# EAGLE design NST-28037B (EAGLE 7.2.0)
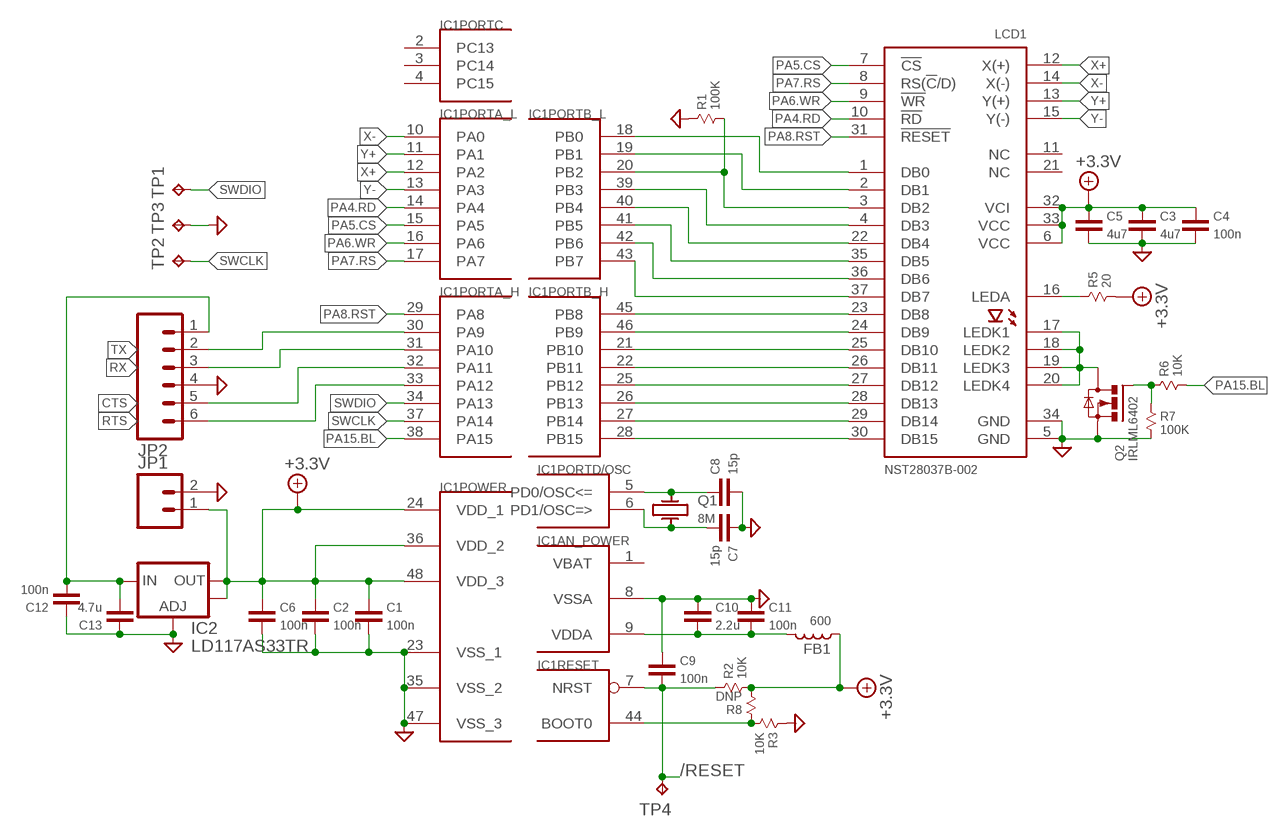
[diagram p0: schematic, sheet 1]

## Parts
C1  100n  CAP-0603  [0603]
C2  100n  CAP-0603  [0603]
C3  4u7  CAP-0603  [0603]
C4  100n  CAP-0603  [0603]
C5  4u7  CAP-0603  [0603]
C6  100n  CAP-0603  [0603]
C7  15p  CAP-0603  [0603]
C8  15p  CAP-0603  [0603]
C9  100n  CAP-0603  [0603]
C10  2.2u  CAP-0603  [0603]
C11  100n  CAP-0603  [0603]
C12  100n  CAP-0603  [0603]
C13  4.7u  CAP-0603  [0603]
FB1  600  INDUCTOR-0603  [0603]
IC1  STM32F10XCXT6  [TQFP48]
IC2  LD117AS33TR  [SOT223]
JP1  M02PTH  [1X02]
JP2  M06SIP  [1X06]
LCD1  NST28037B-002  [NST28037B-002]
Q1  8M  CRYSTAL-KX-9A  [KX-9A]
Q2  IRLML6402  MOSFET-N-SOT23  [SOT-23]
R1  100K  RESISTOR-0603  [0603]
R2  10K  RESISTOR-0603  [0603]
R3  10K  RESISTOR-0603  [0603]
R5  20  RESISTOR-0805  [0805]
R6  10K  RESISTOR-0603  [0603]
R7  100K  RESISTOR-0603  [0603]
R8  DNP  RESISTOR-0603  [0603]
TP1  TPTP12R  [TP12R]
TP2  TPTP12R  [TP12R]
TP3  TPTP12R  [TP12R]
TP4  TPTP12R  [TP12R]

## Nets
+3.3V: C1.2 C2.2 C3.2 C4.2 C5.2 C6.2 FB1.1 IC1.24(POWER:VDD_1) IC1.36(POWER:VDD_2) IC1.48(POWER:VDD_3) IC2.2(OUT) IC2.4(OUT) JP1.1 LCD1.6(VCC) LCD1.32(VCI) LCD1.33(VCC) R2.2 R5.2 R8.2
/RESET: C9.1 IC1.7(RESET:NRST) R2.1 TP4.TP
CTS: IC1.32(PORTA_H:PA11) JP2.5
D0: IC1.18(PORTB_L:PB0) LCD1.1(DB0)
D1: IC1.19(PORTB_L:PB1) LCD1.2(DB1)
D2: IC1.20(PORTB_L:PB2) LCD1.3(DB2) R1.2
D3: IC1.39(PORTB_L:PB3) LCD1.4(DB3)
D4: IC1.40(PORTB_L:PB4) LCD1.22(DB4)
D5: IC1.41(PORTB_L:PB5) LCD1.35(DB5)
D6: IC1.42(PORTB_L:PB6) LCD1.36(DB6)
D7: IC1.43(PORTB_L:PB7) LCD1.37(DB7)
D8: IC1.45(PORTB_H:PB8) LCD1.23(DB8)
D9: IC1.46(PORTB_H:PB9) LCD1.24(DB9)
D10: IC1.21(PORTB_H:PB10) LCD1.25(DB10)
D11: IC1.22(PORTB_H:PB11) LCD1.26(DB11)
D12: IC1.25(PORTB_H:PB12) LCD1.27(DB12)
D13: IC1.26(PORTB_H:PB13) LCD1.28(DB13)
D14: IC1.27(PORTB_H:PB14) LCD1.29(DB14)
D15: IC1.28(PORTB_H:PB15) LCD1.30(DB15)
GND: C1.1 C2.1 C3.1 C4.1 C5.1 C6.1 C7.2 C8.1 C9.2 C10.2 C11.2 C12.2 C13.2 IC1.8(AN_POWER:VSSA) IC1.23(POWER:VSS_1) IC1.35(POWER:VSS_2) IC1.47(POWER:VSS_3) IC2.1(ADJ) JP1.2 JP2.4 LCD1.5(GND) LCD1.34(GND) Q2.2(S) R1.1 R3.1 R7.2 TP3.TP
LEDA-1: LCD1.16(LEDA) R5.1
LEDK: LCD1.17(LEDK1) LCD1.18(LEDK2) LCD1.19(LEDK3) LCD1.20(LEDK4) Q2.3(D)
N$1: C8.2 IC1.5(PORTD/OSC:PD0/OSC<=) Q1.1
N$2: C7.1 IC1.6(PORTD/OSC:PD1/OSC=>) Q1.3
N$3: Q2.1(G) R6.1 R7.1
N$7: C10.1 C11.1 FB1.2 IC1.9(AN_POWER:VDDA)
N$8: IC1.44(RESET:BOOT0) R3.2 R8.1
PA4.RD: IC1.14(PORTA_L:PA4) LCD1.10(!RD)
PA5.CS: IC1.15(PORTA_L:PA5) LCD1.7(!CS)
PA6.WR: IC1.16(PORTA_L:PA6) LCD1.9(!WR)
PA7.RS: IC1.17(PORTA_L:PA7) LCD1.8(RS(!C!/D))
PA8.RST: IC1.29(PORTA_H:PA8) LCD1.31(!RESET)
PA15.BL: IC1.38(PORTA_H:PA15) R6.2
RTS: IC1.33(PORTA_H:PA12) JP2.6
RX: IC1.31(PORTA_H:PA10) JP2.3
SWCLK: IC1.37(PORTA_H:PA14) TP2.TP
SWDIO: IC1.34(PORTA_H:PA13) TP1.TP
TX: IC1.30(PORTA_H:PA9) JP2.2
VIN: C12.1 C13.1 IC2.3(IN) JP2.1
X+: IC1.12(PORTA_L:PA2) LCD1.12(X(+))
X-: IC1.10(PORTA_L:PA0) LCD1.14(X(-))
Y+: IC1.11(PORTA_L:PA1) LCD1.13(Y(+))
Y-: IC1.13(PORTA_L:PA3) LCD1.15(Y(-))
Unconnected: IC1.2(PORTC:PC13) IC1.3(PORTC:PC14) IC1.4(PORTC:PC15) LCD1.11(NC) LCD1.21(NC)

## Power pins joined to a net without a drawn wire
VBAT: IC1.1(AN_POWER:VBAT)

## Library data of the parts
C1-C13 = X893:CAP: Capacitor
FB1 = X893:INDUCTOR: http://www.murata.com/products/catalog/pdf/o05e.pdf
IC1 = stm32:STM32F10XCXT6: ST STM32F101/103 48pin LQFP
IC2 = v-reg:LD117A?*: Low drop fixed and adjustable positive voltage regulators 1 A Source: http://www.st.com/stonline/products/literature/ds/7194/ld1117axx.pdf
JP1 = SparkFun:M02: Header 2 Standard 2-pin 0.1" header. Use with straight break away headers (SKU : PRT-00116), right angle break away headers (PRT-00553), swiss pins (PRT-00743), machine pins (PRT-00117), and female headers (PRT-00115). Molex polarized connector foot print use with SKU : PRT-08233 with associated crimp pins and housings.
JP2 = SparkFun:M06: Header 6 Standard 6-pin 0.1" header. Use with straight break away headers (SKU : PRT-00116), right angle break away headers (PRT-00553), swiss pins (PRT-00743), machine pins (PRT-00117), and female headers (PRT-00115). Molex polarized connector foot print use with SKU : PRT-08094 with associated crimp pins and housings. NOTES ON THE VARIANTS LOCK and LOCK_LONGPADS... This footprint was designed to help hold the alignment of a through-hole component (i.e. 6-pin header) while soldering it into place. You may notice that each hole has been shifted either up or down by 0.005 of an inch from it's more standard position (which is a perfectly straight line). This slight alteration caused the pins (the squares in the middle) to touch the edges of the holes. Because they are alternating, it causes a "brace" to hold the component in place. 0.005 has proven to be the perfect amount of "off-center" position when using our standard breakaway headers. Although looks a little odd when you look at the bare footprint, once you have a header in there, the alteration is very hard to notice. Also, if you push a header all the way into place, it is covered up entirely on the bottom side. This idea of altering the position of holes to aid alignment will be further integrated into the Sparkfun Library for other footprints. It can help hold any component with 3 or more connection pins.
LCD1 = X893:NST28037B-002
Q1 = X893:CRYSTAL: Crystal
Q2 = X893:MOSFET-N
R1-R3 R5-R8 = X893:RESISTOR
TP1-TP4 = testpad:TP: Test pad

## Board
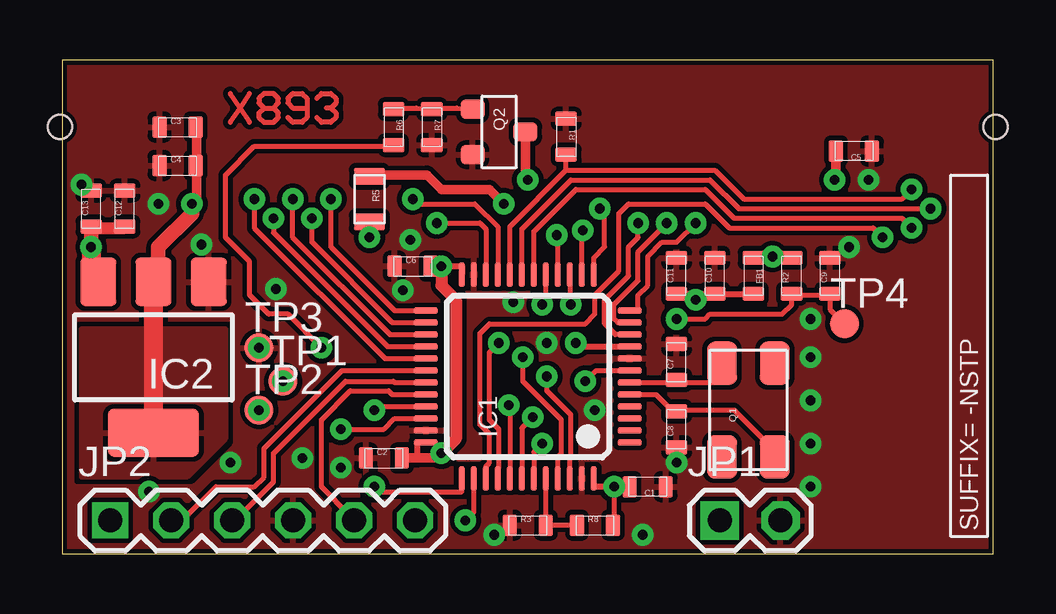
[diagram p1: board, top side]
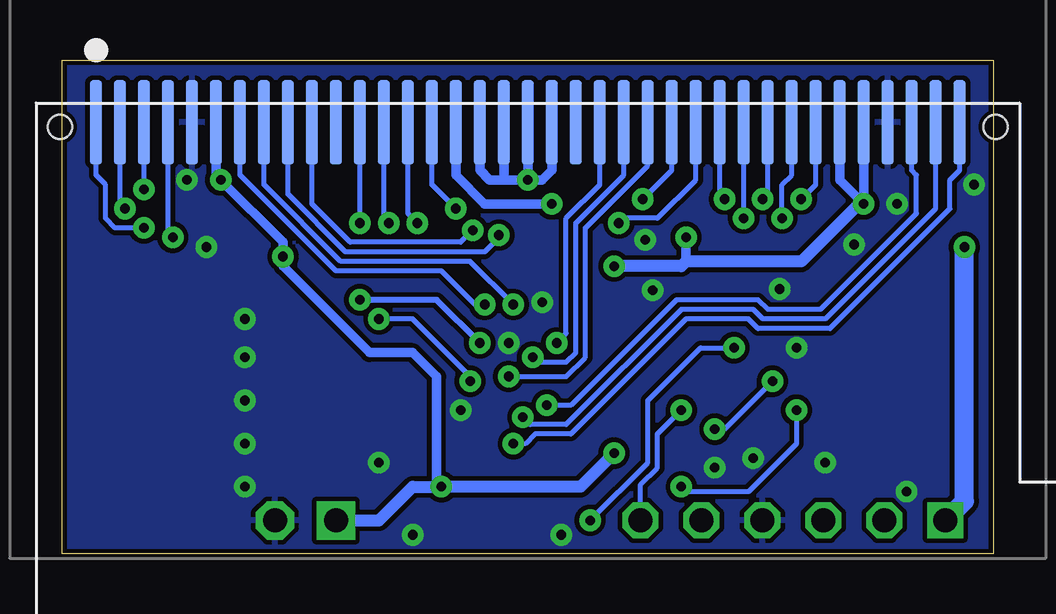
[diagram p2: board, bottom side, seen from below]

Size 38.8 x 20.6 mm. Coordinates in mm from the lower left corner, seen from the top.
Outline: 0,0 38.8,0 38.8,20.6 0,20.6 0,0
Copper layers (1*16): Top 0.035mm / dielectric 1.5mm / Bottom 0.035mm
Design rules "default": minimum track width 0.2mm, minimum drill 0.4mm, track to track 0.2mm, track to pad 0.2mm, pad to pad 0.2mm, via to via 0.2mm, smd to smd 0mil, copper to edge 0.2mm, drill to drill 0.2mm, minimum pad ring 0.25mm, minimum via ring 0.25mm, stop-mask expansion 4mil, vias tented up to drill 0.4mm, thermal gap 0.2mm

### Footprints (pad centres in the part's own frame; a part is rotated, then mirrored left to right if it is on the bottom)
0603 = smd 0.6 x 0.9: 1 -0.75,0; 2 0.75,0
TQFP48 = smd 0.25 x 1: 1 -2.75,-4.25; 2 -2.25,-4.25; 3 -1.75,-4.25; 4 -1.25,-4.25; 5 -0.75,-4.25; 6 -0.25,-4.25; 7 0.25,-4.25; 8 0.75,-4.25; 9 1.25,-4.25; 10 1.75,-4.25; 11 2.25,-4.25; 12 2.75,-4.25; 25 2.75,4.25; 26 2.25,4.25; 27 1.75,4.25; 28 1.25,4.25; 29 0.75,4.25; 30 0.25,4.25; 31 -0.25,4.25; 32 -0.75,4.25; 33 -1.25,4.25; 34 -1.75,4.25; 35 -2.25,4.25; 36 -2.75,4.25 | smd 1 x 0.25: 13 4.25,-2.75; 14 4.25,-2.25; 15 4.25,-1.75; 16 4.25,-1.25; 17 4.25,-0.75; 18 4.25,-0.25; 19 4.25,0.25; 20 4.25,0.75; 21 4.25,1.25; 22 4.25,1.75; 23 4.25,2.25; 24 4.25,2.75; 37 -4.25,2.75; 38 -4.25,2.25; 39 -4.25,1.75; 40 -4.25,1.25; 41 -4.25,0.75; 42 -4.25,0.25; 43 -4.25,-0.25; 44 -4.25,-0.75; 45 -4.25,-1.25; 46 -4.25,-1.75; 47 -4.25,-2.25; 48 -4.25,-2.75
SOT223 = smd 1.5 x 2: 1 -2.3,-3.15; 2 0,-3.15; 3 2.3,-3.15 | smd 3.8 x 2: 4 0,3.15
1X02 = drill 1 pad 1.6 square: 1 0,0 | drill 1 pad 1.6 octagon: 2 2.54,0
1X06 = drill 1 pad 1.5 square: 1 0,0 | drill 1 pad 1.5 octagon: 2 2.54,0; 3 5.08,0; 4 7.62,0; 5 10.16,0; 6 12.7,0
NST28037B-002 = smd 0.5 x 3.5: 1 -18,-3; 2 -17,-3; 3 -16,-3; 4 -15,-3; 5 -14,-3; 6 -13,-3; 7 -12,-3; 8 -11,-3; 9 -10,-3; 10 -9,-3; 11 -8,-3; 12 -7,-3; 13 -6,-3; 14 -5,-3; 15 -4,-3; 16 -3,-3; 17 -2,-3; 18 -1,-3; 19 0,-3; 20 1,-3; 21 2,-3; 22 3,-3; 23 4,-3; 24 5,-3; 25 6,-3; 26 7,-3; 27 8,-3; 28 9,-3; 29 10,-3; 30 11,-3; 31 12,-3; 32 13,-3; 33 14,-3; 34 15,-3; 35 16,-3; 36 17,-3; 37 18,-3 | hole 1: 19.5,-3.2; -19.5,-3.2
KX-9A = smd 1.8 x 1.25: 1 -1.95,-1.1; 2 1.95,-1.1; 3 1.95,1.1; 4 -1.95,1.1
SOT-23 = smd 0.8 x 1: 1 -0.95,-1.1; 2 0.95,-1.1; 3 0,1.1
0805 = smd 0.7 x 1.3: 1 -0.95,0; 2 0.95,0
TP12R = smd 1.2 x 1.2: TP 0,0

### Placement (x,y rotation side)
C1  24.4,2.8 180 top
C2  13.4,4 0 top
C3  4.8,17.8 0 top
C4  4.8,16.2 0 top
C5  33,16.8 180 top
C6  14.6,12 0 top
C7  25.6,8 90 top
C8  25.6,5.2 90 top
C9  32,11.6 90 top
C10  27.2,11.6 90 top
C11  25.6,11.6 90 top
C12  2.6,14.4 90 top
C13  1.2,14.4 90 top
FB1  28.8,11.6 270 top
IC1  19.4,7.4 90 top
IC2  3.8,8.2 180 top
JP1  27.4,1.4 0 top
JP2  2,1.4 0 top
LCD1  19.4,21 0 bottom
Q1  28.6,6 90 top
Q2  18.2,17.6 270 top
R1  21,17.4 270 top
R2  30.4,11.6 90 top
R3  19.4,1.2 0 top
R5  12.8,14.8 270 top
R6  13.8,17.8 270 top
R7  15.4,17.8 270 top
R8  22.2,1.2 0 top
TP1  9.2,7.2 0 top
TP2  8.2,6 0 top
TP3  8.2,8.6 0 top
TP4  32.6,9.6 0 top
U$1  -NSTP  [SUFFIX]  37.8,0.8 90 top

### Tracks (layer width: path | path; a pad name or v marks a point on that pad's centre or on a via)
+3.3V  (via drill 0.4)
  Top 0.2: R8.2 22.96,1.36 23,1.4 v23,2.8
  Top 0.25: v23,2.8 22.15,2.8 IC1.48 | IC1.36 14.8,4.65 14.8,4 | v15.8,12 16.65,12 IC1.24
  Top 0.4: C2.2 14.8,4 15.6,4 v15.8,4.2 | 5.6,16.2 C4.2 | 5.6,16.2 5.6,14.8 v5.4,14.6 | C5.2 32.24,15.64 v32.2,15.6 | FB1.1 28.8,12.4 v29.6,12.4 30.4,12.4 R2.2 | v15.8,12 C6.2 | v12.8,13.2 R5.2 | C3.2 5.6,17.8 5.6,16.2
  Top 0.5: v23,2.8 C1.2 | v15.8,12 15.8,11.2 16.4,10.6 16.4,4.8 v15.8,4.2
  Top 0.6: IC2.2 3.6,11.6 4,12 4,12.8 5.4,14.2 v5.4,14.6
  Top 0.8: IC2.4 IC2.2
  Bottom 0.4: LCD1.33 v5.4,14.6 6.4,15.6 LCD1.32 | LCD1.6 32.4,15.8 v32.2,15.6 29.6,13 v29.6,12.4 29.6,12 26,8.4 24.2,8.4 23.2,7.4 23.2,2.8 | 12.8,12.2 v12.8,13.2
  Bottom 0.5: v15.8,4.2 17.2,2.8 v23,2.8 23.2,2.8 24.2,2.8 25.6,1.4 JP1.1 | v15.8,12 13,12 12.8,12.2 8,12.2 5.6,14.6 v5.4,14.6
  pour Top: 0.8,9.4 6.8,9.4 6.8,4.8 5.2,3.2 0.8,3.2
/RESET  (via drill 0.4)
  Top 0.2: IC1.7 22.25,7.65 v21.8,7.2 | 30.44,10.8 32,10.8 C9.1 32,10.2 TP4.TP | R2.1 30.44,10.8 | R2.1 30.4,10.8 30.44,10.8 | v25.6,9.8 26.8,9.8 27,10 30,10 30.4,10.4 R2.1
  Bottom 0.2: v21.8,7.2 21.8,7.4 24.2,9.8 v25.6,9.8
CTS
  Top 0.2: IC1.32 13.75,6.65 13.6,6.8 12,6.8 10.8,5.6 10.8,2.8 12,1.6 12,1.56 JP2.5
D0  (via drill 0.4)
  Top 0.2: v35.4,13.6 35,14 28,14 26.8,15.2 21.4,15.2 19.65,13.45 IC1.18
  Bottom 0.2: LCD1.1 37.4,15.8 37,15.4 37,14 36.6,13.6 v35.4,13.6
D1  (via drill 0.4)
  Top 0.2: v36.2,14.4 28.2,14.4 27,15.6 21.2,15.6 19.15,13.55 IC1.19
  Bottom 0.2: LCD1.2 36.4,14.6 v36.2,14.4
D2  (via drill 0.4)
  Top 0.2: v35.4,15.2 35,14.8 28.4,14.8 27.2,16 21,16 | IC1.20 18.65,13.65 21,16 | 21,16 R1.2
  Bottom 0.2: v35.4,15.2 LCD1.3
D3  (via drill 0.4)
  Top 0.2: v34.2,13.2 33.8,13.6 27.8,13.6 26.8,14.6 23.6,14.6 23.2,14.2 23.2,11.8 22.2,10.8 22.2,10 21.8,9.6 17.8,9.6 17.4,9.2 17.4,5.4 17.8,5 17.8,3.8 17.65,3.65 IC1.39
  Bottom 0.2: LCD1.4 34.4,13.4 v34.2,13.2
D4  (via drill 0.4)
  Top 0.2: v18.2,8.8 17.8,8.4 17.8,5.6 18.2,5.2 18.2,3.6 18.15,3.55 IC1.40
  Bottom 0.2: v18.2,8.8 17.8,9.2 17.8,14 16.4,15.4 LCD1.22
D5  (via drill 0.4)
  Top 0.2: v18.6,6.2 18.65,6.15 IC1.41
  Bottom 0.2: v18.6,6.2 17.6,6.2 13.2,10.6 9.8,10.6 9.4,10.2 7.2,10.2 3.2,14.2 3.2,15.8 3.4,16 LCD1.35
D6  (via drill 0.4)
  Top 0.2: IC1.42 19.15,5.25 v19.6,5.7
  Bottom 0.2: v19.6,5.7 19.3,5.4 17.8,5.4 13,10.2 10,10.2 9.6,9.8 7,9.8 2.4,14.4 LCD1.36
D7  (via drill 0.4)
  Top 0.2: IC1.43 19.65,4.25 v20,4.6
  Bottom 0.2: v20,4.6 19.5,4.6 19.1,5 17.6,5 12.8,9.8 10.2,9.8 9.8,9.4 6.8,9.4 1.8,14.4 1.8,15.6 1.4,16 LCD1.37
D8  (via drill 0.4)
  Top 0.2: IC1.45 20.65,4.05 20.8,4.2 20.8,5.6 19.2,7.2 v19.2,8.2
  Bottom 0.2: v19.2,8.2 19,8 17.8,8 17.4,8.4 17.4,13.8 15.4,15.8 LCD1.23
D9  (via drill 0.4)
  Top 0.2: IC1.46 21.15,3.95 21.2,4 21.2,5.8 20.2,6.8 v20.2,7.4
  Bottom 0.2: v20.2,7.4 17.8,7.4 17,8.2 17,13.6 14.4,16.2 LCD1.24
D10  (via drill 0.4)
  Top 0.2: v14.6,14.8 14.8,14.6 17.2,14.6 18.15,13.65 IC1.21
  Bottom 0.2: v14.6,14.8 13.4,16 LCD1.25
D11  (via drill 0.4)
  Top 0.2: v15.6,13.8 17.4,13.8 17.65,13.55 IC1.22
  Bottom 0.2: LCD1.26 12.4,15.6 14,14 15.4,14 v15.6,13.8
D12  (via drill 0.4)
  Top 0.2: IC1.25 13.85,10.15 11.2,12.8 v11.2,14.8
  Bottom 0.2: v11.2,14.8 11.4,15 LCD1.27
D13  (via drill 0.4)
  Top 0.2: IC1.26 13.75,9.65 10.4,13 v10.4,14
  Bottom 0.2: v10.4,14 LCD1.28
D14  (via drill 0.4)
  Top 0.2: IC1.27 13.65,9.15 9.6,13.2 v9.6,14.8
  Bottom 0.2: v9.6,14.8 9.4,15 LCD1.29
D15  (via drill 0.4)
  Top 0.2: IC1.28 13.55,8.65 8.8,13.4 v8.8,14
  Bottom 0.2: v8.8,14 8.8,15.4 8.4,15.8 LCD1.30
GND  (via drill 0.4)
  other vias: 20.2,8.8 33.6,15.6 4,14.6 32.8,12.8 5.8,12.9 18.8,10.5 14.5,13.1 25.6,3.8 31.2,6.4 31.2,9.8 11.6,3.6 8.9,11.05 10,4 7,3.8 8.2,8.6 18,0.8 22.2,6 24.2,0.8 31.2,8.2 31.2,4.6 31.2,2.8 3.6,2.6 0.8,15.4 14.2,11
  pour Top (rank 2): 0,0.2 38.8,0.2 38.8,20.6 0,20.6
  pour Bottom: 0,0.2 38.8,0.2 38.8,20.6 0,20.6
LEDA-1  (via drill 0.4)
  Top 0.4: v18.4,14.6 17.8,15.2 15.8,15.2 15.2,15.8 13,15.8 12.9,15.7 R5.1
  Bottom 0.4: LCD1.16 22.4,15.8 21.2,14.6 v18.4,14.6
LEDK  (via drill 0.4)
  Top 0.4: Q2.3 19.3,15.7 v19.4,15.6
  Bottom 0.4: LCD1.17 21.4,16 21,15.6 20.4,15.6 | v19.4,15.6 18.8,15.6 18.4,16 LCD1.20 | v19.4,15.6 20.4,15.6 | v19.4,15.6 LCD1.19 | 20.4,15.6 LCD1.18
N$1
  Top 0.2: IC1.5 24.75,6.65 25.44,5.96 C8.2 25.6,6 28,6 29.2,4.8 29.2,4.6 29.8,4 29.75,3.95 Q1.1
N$2
  Top 0.2: IC1.6 25.51,7.15 C7.1 25.76,7.24 25.8,7.15 27.2,7.15 27.4,7.4 27.4,7.95
  Top 0.25: 27.4,7.95 Q1.3
N$3
  Top 0.2: R6.1 13.8,18.6 14.76,18.6 R7.1 15.4,18.6 16.45,18.6 Q2.1
N$4
  Top 0.2: 7,18 7.4,18.6 | 7.4,18.6 7,19.2 | 7.4,18.6 7.8,19.2 | 7.4,18.6 7.8,18
N$6
  Top 0.2: 8.8,18.6 9,18.4 9,18.2 8.8,18 8.4,18 8.2,18.2 8.2,18.4 8.4,18.6 | 8.4,18.6 8.8,18.6 | 8.8,18.6 9,18.8 9,19 8.8,19.2 8.4,19.2 8.2,19 8.2,18.8 8.4,18.6
N$7  (via drill 0.4)
  Top 0.25: IC1.9 21.55,8.65 v21.4,8.8 | C11.1 26.16,10.84 v26.4,10.6 26.64,10.84 C10.1 FB1.2
  Bottom 0.25: v21.4,8.8 23.2,10.6 v26.4,10.6
N$8
  Top 0.2: R3.2 IC1.44 | R3.2 | R3.2 21.23,1.21 R8.1
N$9
  Top 0.2: 10.2,18.6 10.2,19 10,19.2 9.6,19.2 9.4,19 9.4,18.8 9.6,18.6 10.2,18.6 | 10.2,18.6 10.2,18.2 10,18 9.6,18 9.4,18.2
N$10
  Top 0.2: 10.6,19 10.8,19.2 11.2,19.2 11.4,19 11.4,18.8 11.2,18.6 | 11.2,18.6 11.4,18.4 11.4,18.2 11.2,18 10.8,18 10.6,18.2 | 11.2,18.6 11,18.6
PA4.RD  (via drill 0.4)
  Top 0.2: IC1.14 21.65,13.45 v21.7,13.5
  Bottom 0.2: v21.7,13.5 22.2,13 26.8,13 28.4,14.6 LCD1.10
PA5.CS  (via drill 0.4)
  Top 0.2: IC1.15 21.15,10.55 v21.2,10.4
  Bottom 0.2: v21.2,10.4 21.6,10.4 23,11.8 27.4,11.8 31.4,15.8 LCD1.7
PA6.WR  (via drill 0.4)
  Top 0.2: IC1.16 20.65,13.25 v20.6,13.3
  Bottom 0.2: v20.6,13.3 20.6,13.2 21.2,12.6 27,12.6 29.4,15 LCD1.9
PA7.RS  (via drill 0.4)
  Top 0.2: IC1.17 20.15,10.55 v20,10.4
  Bottom 0.2: v20,10.4 21.8,12.2 27.2,12.2 30.4,15.4 LCD1.8
PA8.RST  (via drill 0.4)
  Top 0.2: IC1.29 13.45,8.15 8,13.6 v8,14.8
  Bottom 0.2: v8,14.8 7.4,15.4 LCD1.31
PA15.BL  (via drill 0.4)
  Top 0.2: R6.2 13.8,17 8,17 6.8,15.8 6.8,13.2 7.8,12.2 7.8,10.8 8.6,10 9.4,10 v10.8,8.6 | IC1.38 17.15,1.75 v16.8,1.4
  Bottom 0.2: v16.8,1.4 14.4,3.8 14.4,6.4 12.2,8.6 v10.8,8.6
RTS  (via drill 0.4)
  Top 0.2: IC1.33 13.15,6.15 v13,6
  Bottom 0.2: JP2.6 14.7,2.9 14,3.6 14,5 v13,6
RX
  Top 0.2: IC1.31 13.85,7.15 13.8,7.2 11.8,7.2 8.8,4.2 8.8,3 7.2,1.4 7.2,1.48 JP2.3
SWCLK  (via drill 0.4)
  Top 0.2: IC1.37 16.65,2.6 13.2,2.6 v13,2.8
  Bottom 0.2: v13,2.8 12.8,2.6 10.2,2.6 8.2,4.6 TP2.TP
  other vias: 8.2,6
SWDIO  (via drill 0.4)
  Top 0.2: IC1.34 13.85,5.65 13.4,5.2 v11.6,5.2
  Bottom 0.2: TP1.TP 11.2,5.2 v11.6,5.2
  other vias: 9.2,7.2
TX
  Top 0.2: IC1.30 11.65,7.65 8.4,4.4 8.4,3.2 8,2.8 6.4,2.8 5,1.4 JP2.2
VIN  (via drill 0.4)
  Top 0.5: 1.2,13.6 2.6,13.6 C12.1
  Top 0.6: v1.2,12.8 1.2,13.6 C13.1
  Top 0.8: IC2.3 1.2,11.35 v1.2,12.8
  Bottom 0.8: v1.2,12.8 1.2,2.2 JP2.1
X+  (via drill 0.4)
  Top 0.2: IC1.12 24,10.15 24,10.8 24.4,11.2 24.4,12.4 25,13 25.6,13 v26.4,13.8
  Bottom 0.2: v26.4,13.8 LCD1.12
X-  (via drill 0.4)
  Top 0.2: v24,13.8 24,13.2 23.6,12.8 23.6,11.6 22.6,10.6 22.6,9.6 23.05,9.15 IC1.10
  Bottom 0.2: v24,13.8 24.4,14.2 LCD1.14
Y+  (via drill 0.4)
  Top 0.2: v25.2,13.8 24,12.6 24,11.4 23,10.4 23,9.8 23.15,9.65 IC1.11
  Bottom 0.2: v25.2,13.8 25.4,14 LCD1.13
Y-  (via drill 0.4)
  Top 0.2: v22.4,14.4 22.6,14.2 22.6,12.8 22.15,12.35 IC1.13
  Bottom 0.2: LCD1.15 23.4,15.4 v22.4,14.4

### Text on the board
Reference: Y- | X- | Y+ | X+ | SWD | SWC | VIN +5V | TX | RX | GND | CTS | RTS | +3.3V | RESET